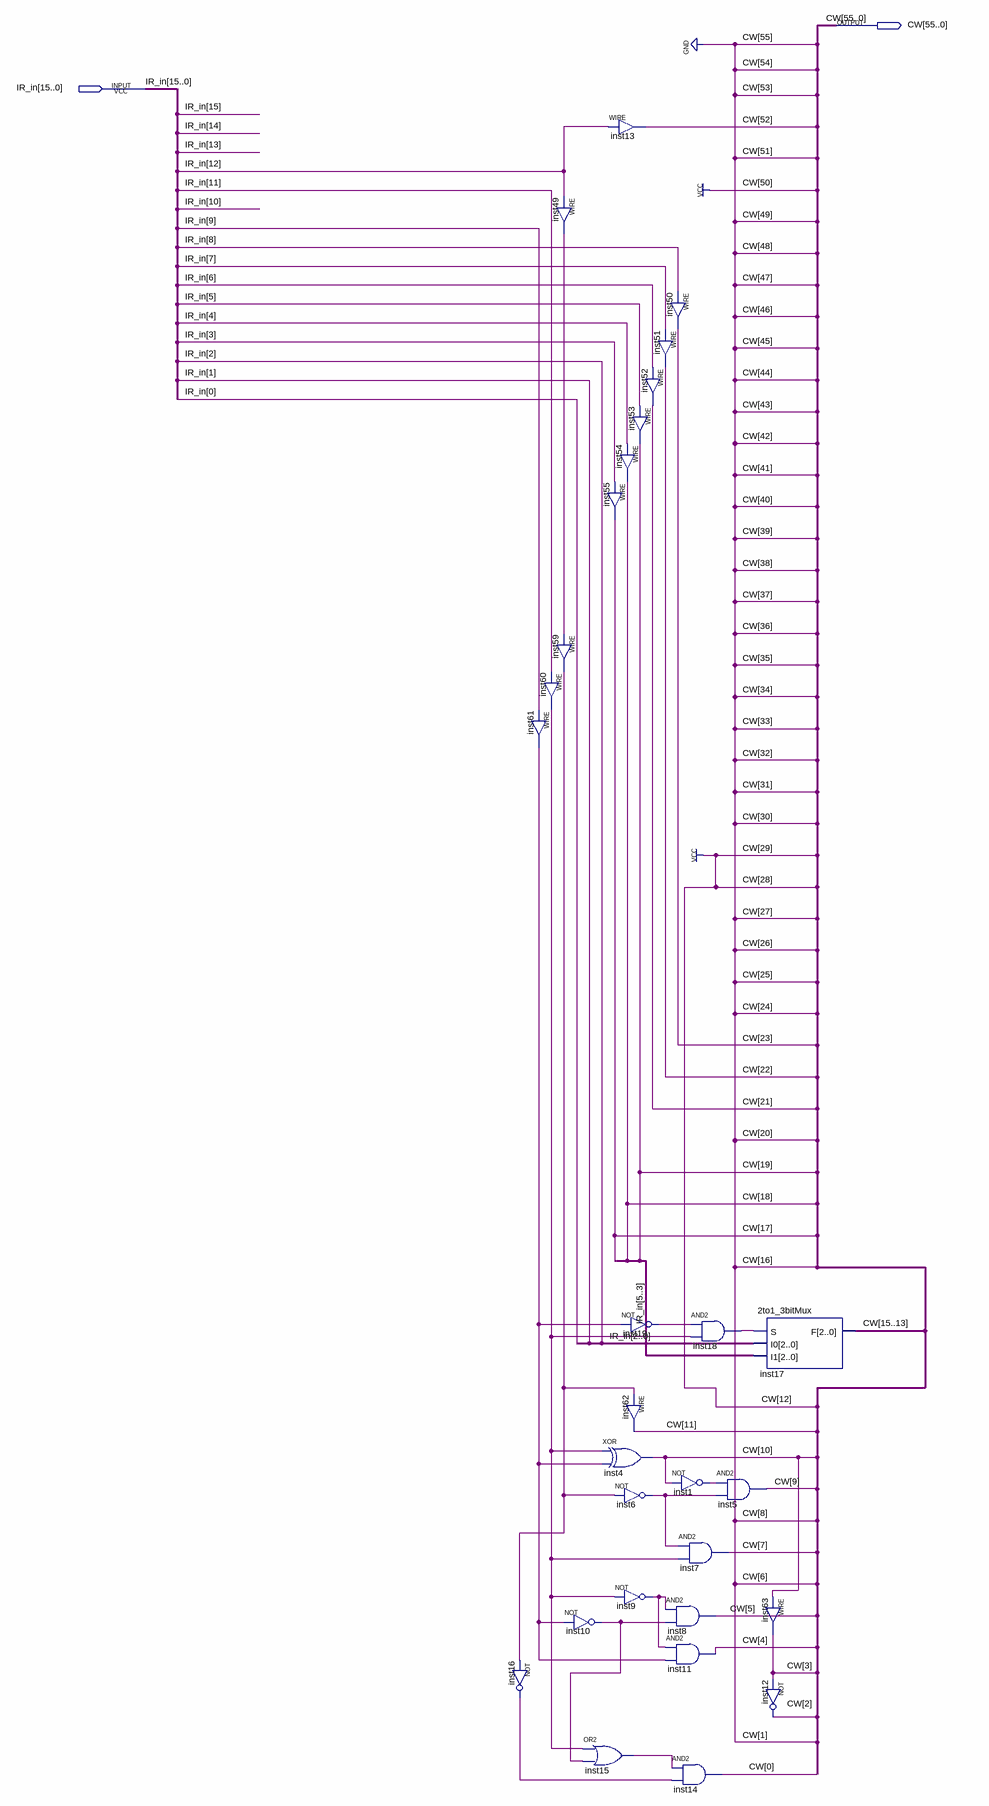
[diagram p0: schematic sheet]
// Quartus schematic Execute0_10_Stack.bdf as structural Verilog: 29 symbols, 2 pins
module Execute0_10_Stack (
  input  [15:0] IR_in,
  output [55:0] CW
);

  wire inst1_out, inst6_out, inst9_out, inst10_out, inst15_out, inst16_out, inst18_out, inst19_out,
       inst49_out, inst59_out, inst60_out, inst61_out;

  assign inst60_out = IR_in[11];  // WIRE inst60
  assign inst61_out = IR_in[9];  // WIRE inst61
  not inst16 (inst16_out, inst59_out);
  assign inst49_out = IR_in[12];  // WIRE inst49
  assign inst59_out = inst49_out;  // WIRE inst59
  not inst10 (inst10_out, inst61_out);
  or inst15 (inst15_out, inst60_out, inst10_out);
  assign CW[52] = IR_in[12];  // WIRE inst13
  assign CW[21] = IR_in[6];  // WIRE inst52
  assign CW[19] = IR_in[5];  // WIRE inst53
  assign CW[18] = IR_in[4];  // WIRE inst54
  assign CW[17] = IR_in[3];  // WIRE inst55
  not inst19 (inst19_out, inst61_out);
  assign CW[11] = inst59_out;  // WIRE inst62
  xor inst4 (CW[10], inst60_out, inst61_out);
  not inst6 (inst6_out, inst59_out);
  not inst9 (inst9_out, inst60_out);
  assign CW[23] = IR_in[8];  // WIRE inst50
  assign CW[22] = IR_in[7];  // WIRE inst51
  and inst18 (inst18_out, inst19_out, inst60_out);
  not inst1 (inst1_out, CW[10]);
  and inst7 (CW[7], inst6_out, inst60_out);
  and inst8 (CW[5], inst9_out, inst10_out);
  and inst11 (CW[4], inst9_out, inst61_out);
  and inst14 (CW[0], inst15_out, inst16_out);
  and inst5 (CW[9], inst1_out, inst6_out);
  \2to1_3bitMux  inst17 (.S(inst18_out), .I0(IR_in[2:0]), .I1(IR_in[5:3]), .F(CW[15:13]));
  assign CW[3] = CW[10];  // WIRE inst63
  not inst12 (CW[2], CW[3]);

  assign {CW[55:53], CW[51:24], CW[20], CW[16], CW[12], CW[8], CW[6], CW[1]} = 37'b0000100000000000000000000110000001000;
endmodule
